# EAGLE design TopPCB_v2 (EAGLE 7.5.0)
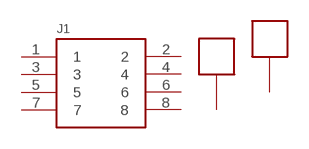
[diagram p0: schematic, sheet 1]

## Parts
J1  SLW-104-01-X-D  [SLW-104-01-X-D]
U$14  KEYSTONE_W/NICHROME_5016  [KEYSTONE_W/NICHROME_5016]
U$16  KEYSTONE_W/NICHROME_5016  [KEYSTONE_W/NICHROME_5016]
Unconnected: J1.1 J1.2 J1.3 J1.4 J1.5 J1.6 J1.7 J1.8 U$14.P$1 U$16.P$1

## Library data of the parts
J1 = I_O_connectors:SLW-104-01-X-D: Low Profile Contact Socket Strip, Double Row Through Hole.
U$14 U$16 = I_O_connectors:KEYSTONE_W/NICHROME_5016

## Board
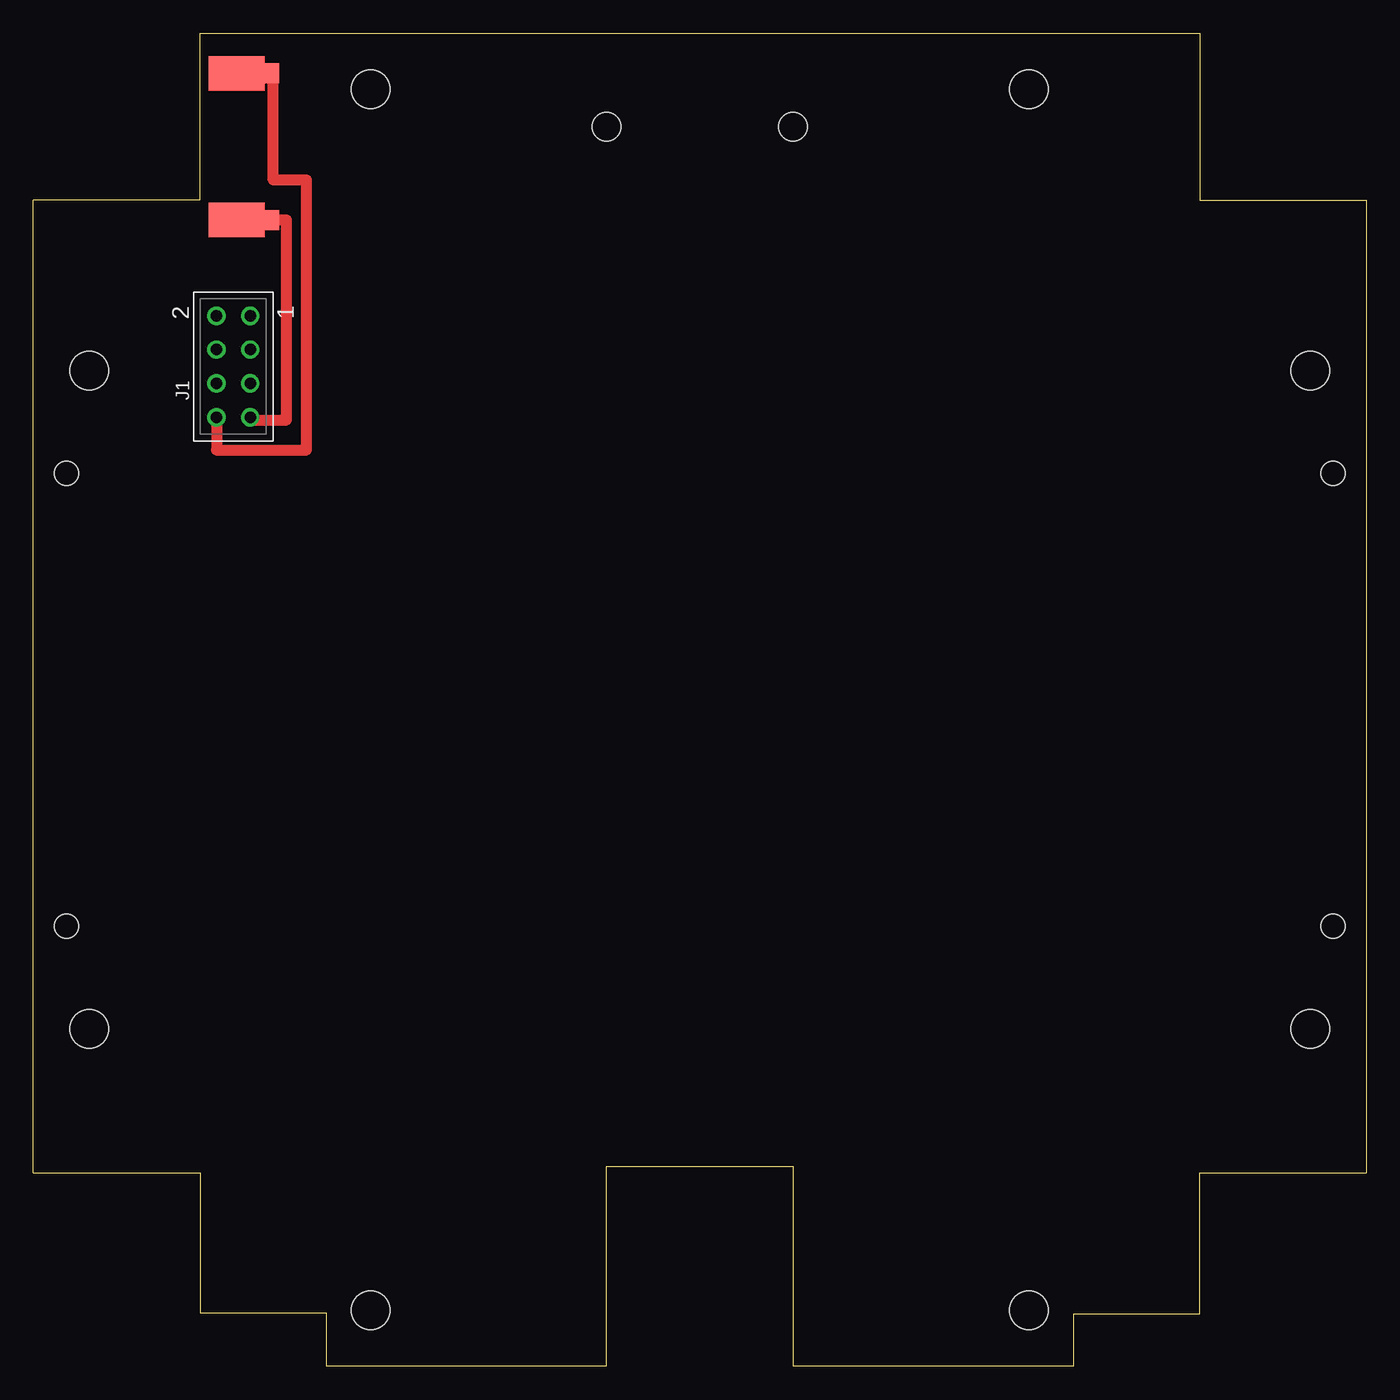
[diagram p1: board, top side]
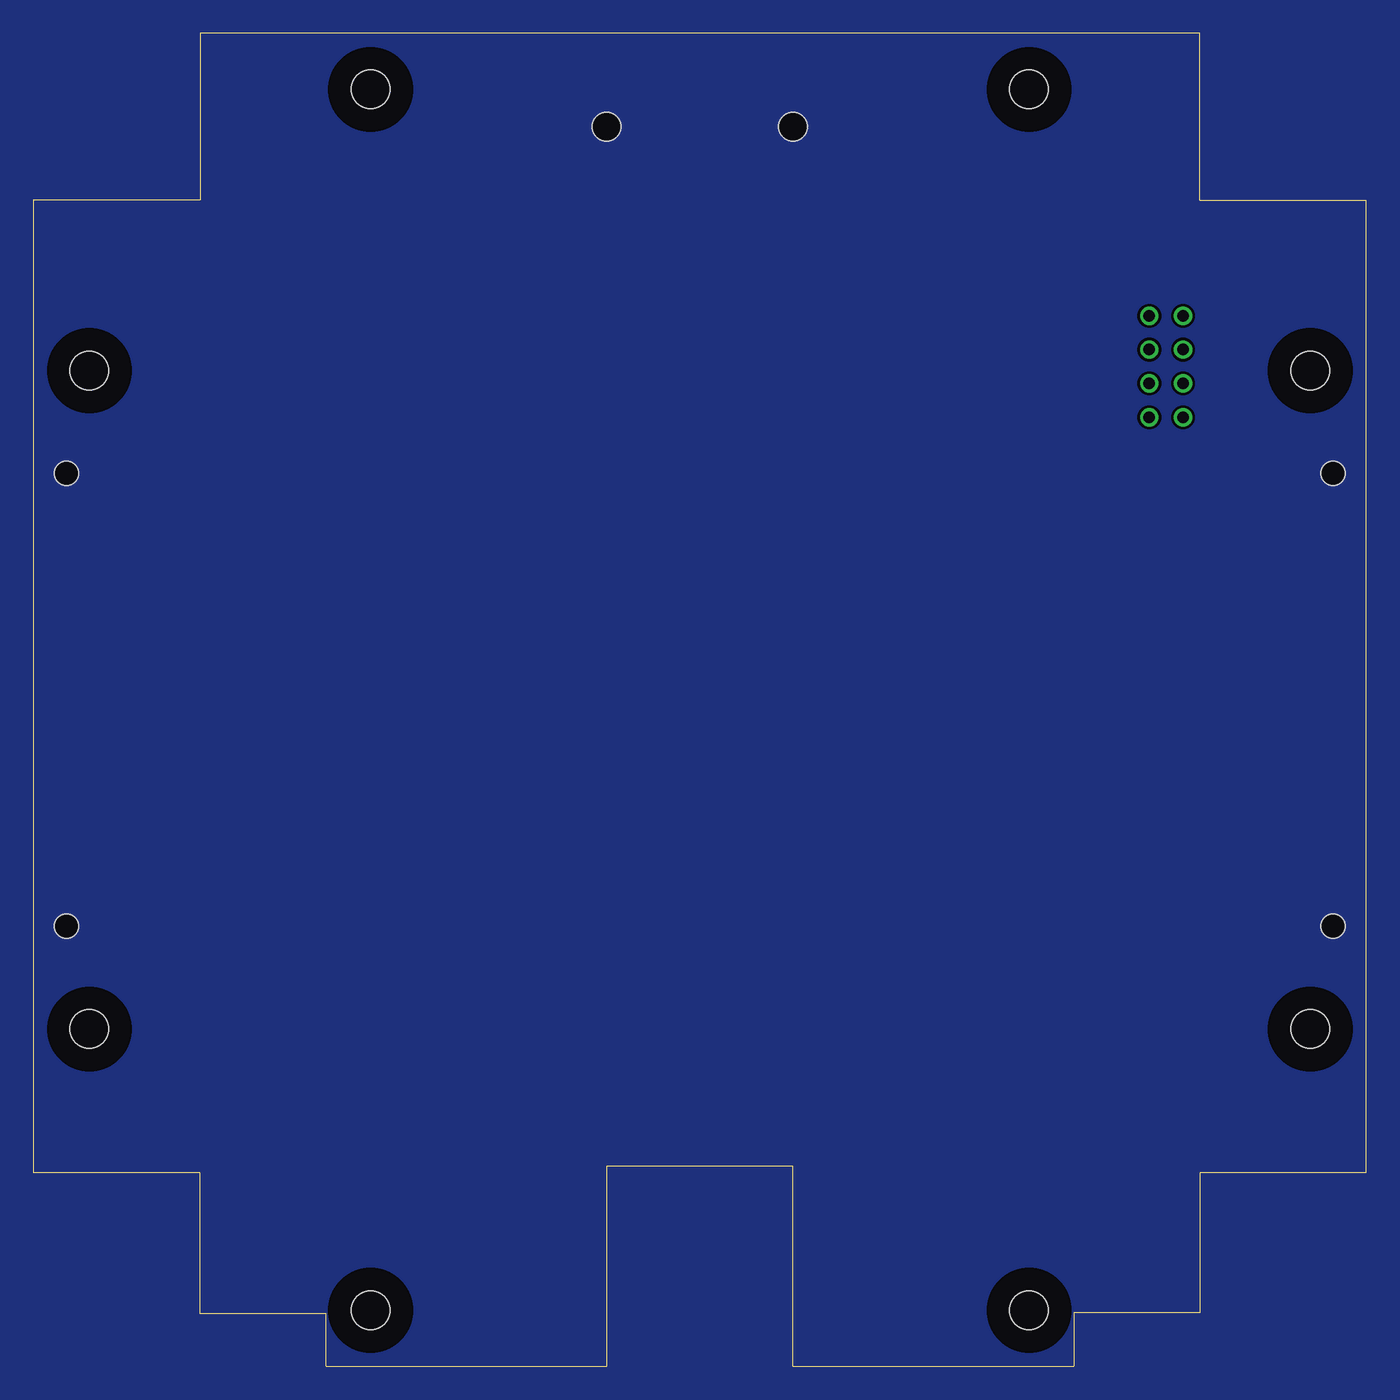
[diagram p2: board, bottom side, seen from below]

Size 100 x 100 mm. Coordinates in mm from the lower left corner, seen from the top.
Outline: 0,14.5 0,87.5 12.5,87.5 12.5,100 87.5,100 87.5,87.5 100,87.5 100,14.5 87.5,14.5 87.5,3.95 78.05,3.95 78.05,0 57,0 57,15 43,15 43,0 21.95,0 21.95,3.99 12.5,3.99 12.5,14.5 0,14.5
Copper layers (1*16): Top 0.035mm / dielectric 1.5mm / Bottom 0.035mm
Design rules "default *": minimum track width 10mil, minimum drill 24mil, track to track 8mil, track to pad 8mil, pad to pad 8mil, via to via 8mil, smd to smd 8mil, copper to edge 0mil, drill to drill 8mil, minimum pad ring 10mil, minimum via ring 8mil, stop-mask expansion 4mil, vias tented up to drill 0mil, thermal gap 10mil

### Footprints (pad centres in the part's own frame; a part is rotated, then mirrored left to right if it is on the bottom)
SLW-104-01-X-D = drill 0.864 pad 1.295: 1 3.81,-1.27; 2 3.81,1.27; 3 1.27,-1.27; 4 1.27,1.27; 5 -1.27,-1.27; 6 -1.27,1.27; 7 -3.81,-1.27; 8 -3.81,1.27
#1-72_BOLT_HOLE = hole 1.804: 0,0
#2-56_BOLT_HOLE = hole 2.15: 0,0
#4-40_BOLT_HOLE = hole 2.9: 0,0
KEYSTONE_W/NICHROME_5016 = smd 4.2 x 2.6: P$1 0,0 | smd 1.27 x 1.5: P$2 -2.54,0

### Placement (x,y rotation side)
J1  15,75 90 top
U$1  [#1-72_BOLT_HOLE]  2.5,67 0 top
U$2  [#1-72_BOLT_HOLE]  2.5,33 0 top
U$3  [#1-72_BOLT_HOLE]  97.5,33 0 top
U$4  [#1-72_BOLT_HOLE]  97.5,67 0 top
U$5  [#2-56_BOLT_HOLE]  43,93 0 top
U$6  [#4-40_BOLT_HOLE]  4.2,74.7 0 top
U$7  [#4-40_BOLT_HOLE]  95.8,74.7 0 top
U$8  [#2-56_BOLT_HOLE]  57,93 0 top
U$9  [#4-40_BOLT_HOLE]  25.3,95.8 0 top
U$10  [#4-40_BOLT_HOLE]  25.3,4.2 0 top
U$11  [#4-40_BOLT_HOLE]  4.2,25.3 0 top
U$12  [#4-40_BOLT_HOLE]  95.8,25.3 0 top
U$13  [#4-40_BOLT_HOLE]  74.7,4.2 0 top
U$14  15.25,97 180 top
U$15  [#4-40_BOLT_HOLE]  74.7,95.8 0 top
U$16  15.25,86 180 top

### Tracks (layer width: path | path; a pad name or v marks a point on that pad's centre or on a via)
N$1
  pour Bottom: -5,105 105,105 105,-5 -5,-5
N$2
  Top 0.813: 16.25,71 19,71 19,86 16,86
N$3
  Top 0.813: 13.75,71 13.75,68.75 20.5,68.75 20.5,89 18,89 18,97